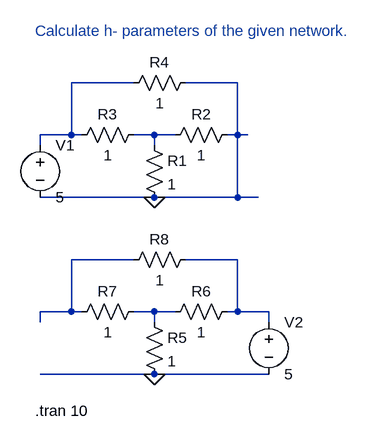
[diagram p0: schematic Lab7_ques2.asc]
Lab7_ques2.asc, the LTspice schematic file:
Version 4
SHEET 1 880 680
WIRE 112 128 16 128
WIRE 272 128 192 128
WIRE 16 208 16 128
WIRE 16 208 -32 208
WIRE 32 208 16 208
WIRE 144 208 112 208
WIRE 176 208 144 208
WIRE 272 208 272 128
WIRE 272 208 256 208
WIRE 288 208 272 208
WIRE -32 224 -32 208
WIRE 144 224 144 208
WIRE 144 304 -32 304
WIRE 272 304 272 208
WIRE 272 304 144 304
WIRE 304 304 272 304
WIRE 112 400 16 400
WIRE 272 400 192 400
WIRE 16 480 16 400
WIRE 16 480 -32 480
WIRE 32 480 16 480
WIRE 144 480 112 480
WIRE 176 480 144 480
WIRE 272 480 272 400
WIRE 272 480 256 480
WIRE 320 480 272 480
WIRE -32 496 -32 480
WIRE 144 496 144 480
WIRE 320 496 320 480
WIRE 144 576 -32 576
WIRE 320 576 144 576
FLAG 144 576 0
FLAG 144 304 0
SYMBOL Res 128 208 R0
SYMATTR InstName R1
SYMATTR Value 1
SYMBOL Res 272 192 R90
WINDOW 0 0 56 VBottom 2
WINDOW 3 32 56 VTop 2
SYMATTR InstName R2
SYMATTR Value 1
SYMBOL Res 128 192 R90
WINDOW 0 0 56 VBottom 2
WINDOW 3 32 56 VTop 2
SYMATTR InstName R3
SYMATTR Value 1
SYMBOL Res 208 112 R90
WINDOW 0 0 56 VBottom 2
WINDOW 3 32 56 VTop 2
SYMATTR InstName R4
SYMATTR Value 1
SYMBOL Voltage -32 208 R0
SYMATTR InstName V1
SYMATTR Value 5
SYMBOL Res 128 480 R0
SYMATTR InstName R5
SYMATTR Value 1
SYMBOL Res 272 464 R90
WINDOW 0 0 56 VBottom 2
WINDOW 3 32 56 VTop 2
SYMATTR InstName R6
SYMATTR Value 1
SYMBOL Res 128 464 R90
WINDOW 0 0 56 VBottom 2
WINDOW 3 32 56 VTop 2
SYMATTR InstName R7
SYMATTR Value 1
SYMBOL Res 208 384 R90
WINDOW 0 0 56 VBottom 2
WINDOW 3 32 56 VTop 2
SYMATTR InstName R8
SYMATTR Value 1
SYMBOL Voltage 320 480 R0
SYMATTR InstName V2
SYMATTR Value 5
TEXT -40 48 Left 2 ;Calculate h- parameters of the given network.
TEXT -40 632 Left 2 !.tran 10

The netlist it stands for:
* Lab7_ques2.asc
R1 N002 0 1
R2 0 N002 1
R3 N002 N001 1
R4 0 N001 1
V1 N001 0 5
R5 N005 0 1
R6 N004 N005 1
R7 N005 N003 1
R8 N004 N003 1
V2 N004 0 5
* Calculate h- parameters of the given network.
.tran 10
.backanno
.end